# Altium schematic sheet POWER_UNIT.SchDoc
size A4
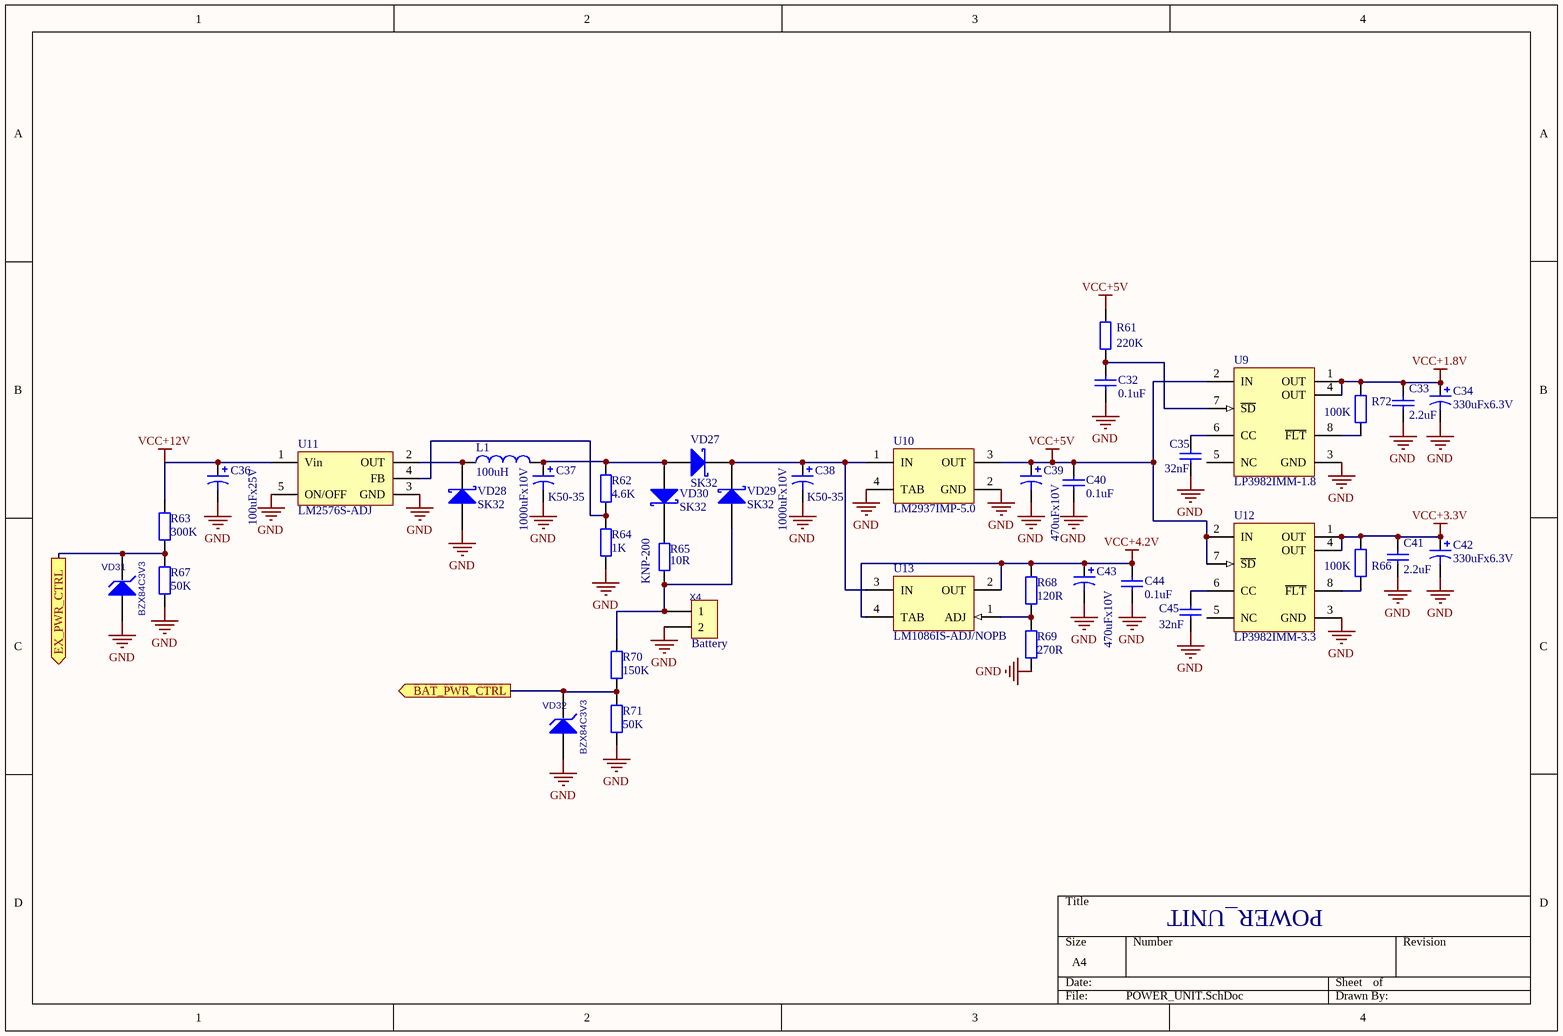
[diagram p0: POWER_UNIT.SchDoc]

## Parts
C32  value 0.1uF  [C0603]  (hidden comment: 0805)
C33  value 2.2uF  [C0603]  (hidden comment: 0805)
C34  value 330uFx6.3V  [Capasitor_POL_SMD D6.3]  (hidden comment: SMD_cap)
C35  value 32nF  [C0603]  (hidden comment: 0805)
C36  value 100uFx25V  [CAP_POL_D6.3]  (hidden comment: K50-35)
C37  K50-35  value 1000uFx10V  [CAP_POL_D10]
C38  K50-35  value 1000uFx10V  [CAP_POL_D10]
C39  value 470uFx10V  [Capasitor_POL_SMD D8]  (hidden comment: SMD_cap)
C40  value 0.1uF  [C0603]  (hidden comment: 0805)
C41  value 2.2uF  [C0603]  (hidden comment: 0805)
C42  value 330uFx6.3V  [Capasitor_POL_SMD D6.3]  (hidden comment: SMD_cap)
C43  value 470uFx10V  [Capasitor_POL_SMD D8]  (hidden comment: SMD_cap)
C44  value 0.1uF  [C0603]  (hidden comment: 0805)
C45  value 32nF  [C0603]  (hidden comment: 0805)
L1  value 100uH  [Inductor_SMD_12.5x12.5]  (hidden comment: B82477P4)
R61  value 220K  [C0603]  (hidden comment: RES)
R62  value 4.6K  [C0603]  (hidden comment: RES)
R63  value 300K  [C0603]  (hidden comment: RES)
R64  value 1K  [C0603]  (hidden comment: RES)
R65  KNP-200  value 10R  [Resistor KNP-200]
R66  value 100K  [C0603]  (hidden comment: RES)
R67  value 50K  [C0603]  (hidden comment: RES)
R68  value 120R  [C0805]  (hidden comment: RES)
R69  value 270R  [C0805]  (hidden comment: RES)
R70  value 150K  [C0603]  (hidden comment: RES)
R71  value 50K  [C0603]  (hidden comment: RES)
R72  value 100K  [C0603]  (hidden comment: RES)
U9  LP3982IMM-1.8  [MUA08A_N]
U10  LM2937IMP-5.0  [MP04A_N]
U11  LM2576S-ADJ  [TO-263-5]
U12  LP3982IMM-3.3  [MUA08A_N]
U13  LM1086IS-ADJ/NOPB  [TS3B_N]
VD27  SK32  [SMC]
VD28  SK32  [SMC]
VD29  SK32  [SMC]
VD30  SK32  [SMC]
VD31  BZX84C3V3  [SOT23]
VD32  BZX84C3V3  [SOT23]
X4  value Battery  [DG350-3.5-2P]  (hidden comment: DG350-3.5-2P)

## Ports
BAT_PWR_CTRL (out), EX_PWR_CTRL (out)

## Nets
GND: C32.2 C33.2 C34.2 C35.2 C36.2 C37.2 C38.2 C39.2 C40.2 C41.2 C42.2 C43.2 C44.2 C45.2 R64.1 R67.1 R69.1 R71.1 U9.3(GND) U10.2(GND) U10.4(TAB) U11.3(GND) U11.5(ON/OFF) U12.3(GND) VD28.2(A) VD31.1(A) VD32.1(A) X4.2
VCC+1.8V: C33.1 C34.1 R72.2 U9.1(OUT) U9.4(OUT)
VCC+3.3V: C41.1 C42.1 R66.2 U12.1(OUT) U12.4(OUT)
VCC+4.2V: C43.1 C44.1 R68.2 U13.2(OUT) U13.4(TAB)
VCC+5V: C39.1 C40.1 R61.2 U9.2(IN) U10.3(OUT) U12.2(IN) U12.7(~{SD})
VCC+12V: C36.1 R63.2 U11.1(Vin)
BAT_PWR_CTRL: R70.1 R71.2 VD32.3(K) ; port BAT_PWR_CTRL
EX_PWR_CTRL: R63.1 R67.2 VD31.3(K) ; port EX_PWR_CTRL
NetC32_1: C32.1 R61.1 U9.7(~{SD})
NetC35_1: C35.1 U9.6(CC)
NetC37_1: C37.1 L1.2 R62.2 VD27.2(A) VD30.2(A)
NetC38_1: C38.1 U10.1(IN) U13.3(IN) VD27.1(K) VD29.1(K)
NetC45_1: C45.1 U12.6(CC)
NetL1_1: L1.1 U11.2(OUT) VD28.1(K)
NetR62_1: R62.1 R64.2 U11.4(FB)
NetR65_1: R65.1 R70.2 VD29.2(A) X4.1
NetR65_2: R65.2 VD30.1(K)
NetR66_1: R66.1 U12.8(~{FLT})
NetR68_1: R68.1 R69.2 U13.1(ADJ)
NetR72_1: R72.1 U9.8(~{FLT})

Not connected (* = marked no-connect by the designer): U9 5(NC); U12 5(NC); VD31 2; VD32 2

## Notes on the sheet
- POWER_UNIT

## Library data of the parts
C32 C33 C35 C40 C41 C44 C45 = Capasitor_SMD_0805: Capasitor_SMD_0808/
C34 C42 = Capasitor_POL_SMD D8.0
C36 = Capasitor_pol D6.3
C37 C38 = Capasitor_pol D10
C39 C43 = Capasitor_POL_SMD D8.0: size 8x10.5
R61-R64 R66-R72 = RES: Resistor
R65 = Resistor 2W
U9 = LP3982IMM-1.8: Micropower, Ultra Low-Dropout, Low-Noise, 300mA CMOS Regulator, 8-pin Mini SOIC; Manufacturer: National Semiconductor; PackageTopMarking: ZXTT*LENB; PowerWise: N; CompType: LDO IC; Published: 4-Dec-2008; DatasheetVersion: Mar-2006; PackageVersion: revF, Apr-2008; PackageReference: MUA08A; Publisher: Altium Limited; PackageDescription: MINI SOIC, .118 x .118 x .034in, 8 Lead, .0256in Pitch; PartNumber: LP3982IMM-1.8; RoHS: N; PinCount: 8; Code_JEDEC: MO-187-AA; ComponentLink1Description: LP3982 Datasheet; ComponentLink1URL: http://www.national.com/ds/LP/LP3982.pdf; ComponentLink2Description: LP3982 Web Page; ComponentLink2URL: http://www.national.com/pf/LP/LP3982.html; ComponentLink3Description: MUA08A Package Page; ComponentLink3URL: http://www.national.com/packaging/folders/mua08a.html
U10 = LM2937IMP-5.0: 500 mA Low Dropout Regulator, 4-pin SOT-223; Manufacturer: National Semiconductor; PackageTopMarking: XYTT*L71B; PowerWise: N; CompType: LDO IC; Published: 4-Dec-2008; DatasheetVersion: Aug-2005; PackageVersion: revB, Apr-2003; PackageReference: MP04A; Publisher: Altium Limited; PackageDescription: Molded SOT-223, 6.50 x 3.56 x 1.6mm Body, 4 Lead, 2.3mm Pitch; Supplier 1: Farnell; Supplier Part Number 1: 3331209; PartNumber: LM2937IMP-5.0; RoHS: N; PinCount: 4; Code_JEDEC: TO-261-AA; Code_IPC: SOT223-4; ComponentLink1Description: LM2937 Datasheet; ComponentLink1URL: http://www.national.com/ds/LM/LM2937.pdf; ComponentLink2Description: LM2937 Web Page; ComponentLink2URL: http://www.national.com/pf/LM/LM2937.html; ComponentLink3Description: MP04A Package Page; ComponentLink3URL: http://www.national.com/packaging/folders/mp04a.html
U12 = LP3982IMM-3.3: Micropower, Ultra Low-Dropout, Low-Noise, 300mA CMOS Regulator, 8-pin Mini SOIC; Manufacturer: National Semiconductor; PackageTopMarking: ZXTT*LEUB; PowerWise: N; CompType: LDO IC; Published: 4-Dec-2008; DatasheetVersion: Mar-2006; PackageVersion: revF, Apr-2008; PackageReference: MUA08A; Publisher: Altium Limited; PackageDescription: MINI SOIC, .118 x .118 x .034in, 8 Lead, .0256in Pitch; Supplier 1: Farnell; Supplier Part Number 1: 9779590; PartNumber: LP3982IMM-3.3; RoHS: N; PinCount: 8; Code_JEDEC: MO-187-AA; ComponentLink1Description: LP3982 Datasheet; ComponentLink1URL: http://www.national.com/ds/LP/LP3982.pdf; ComponentLink2Description: LP3982 Web Page; ComponentLink2URL: http://www.national.com/pf/LP/LP3982.html; ComponentLink3Description: MUA08A Package Page; ComponentLink3URL: http://www.national.com/packaging/folders/mua08a.html
U13 = LM1086IS-ADJ/NOPB: 1.5A Low Dropout Positive Regulators, 3-pin TO-263, Pb-Free; Manufacturer: National Semiconductor; PackageTopMarking: NSUZXYTTE#*LM1086*IS-ADJ; PowerWise: N; CompType: LDO IC; Published: 1-Mar-2010; DatasheetVersion: Jun-2005; PackageVersion: revF, Apr-2005; PackageReference: TS3B; Publisher: Altium Limited; PackageDescription: TO-263, Molded, .400 x .390 x .180in, 3 Lead, .1in Pitch, Surface Mount; Supplier 1: Digi-Key; Supplier Part Number 1: LM1086IS-ADJ-ND; Supplier 2: Farnell; Supplier Part Number 2: 1469045; PartNumber: LM1086IS-ADJ/NOPB; RoHS: Y; PinCount: 3; Code_JEDEC: MO-169-AA; ComponentLink1Description: LM1086 Datasheet; ComponentLink1URL: http://www.national.com/ds/LM/LM1086.pdf; ComponentLink2Description: LM1086 Web Page; ComponentLink2URL: http://www.national.com/pf/LM/LM1086.html; ComponentLink3Description: TS3B Package Page; ComponentLink3URL: http://www.national.com/packaging/folders/ts3b.html
VD31 VD32 = BZX84C: Value: *